# Altium schematic sheet Information.SchDoc
size B; SheetNumber: 1; SheetTotal: 15
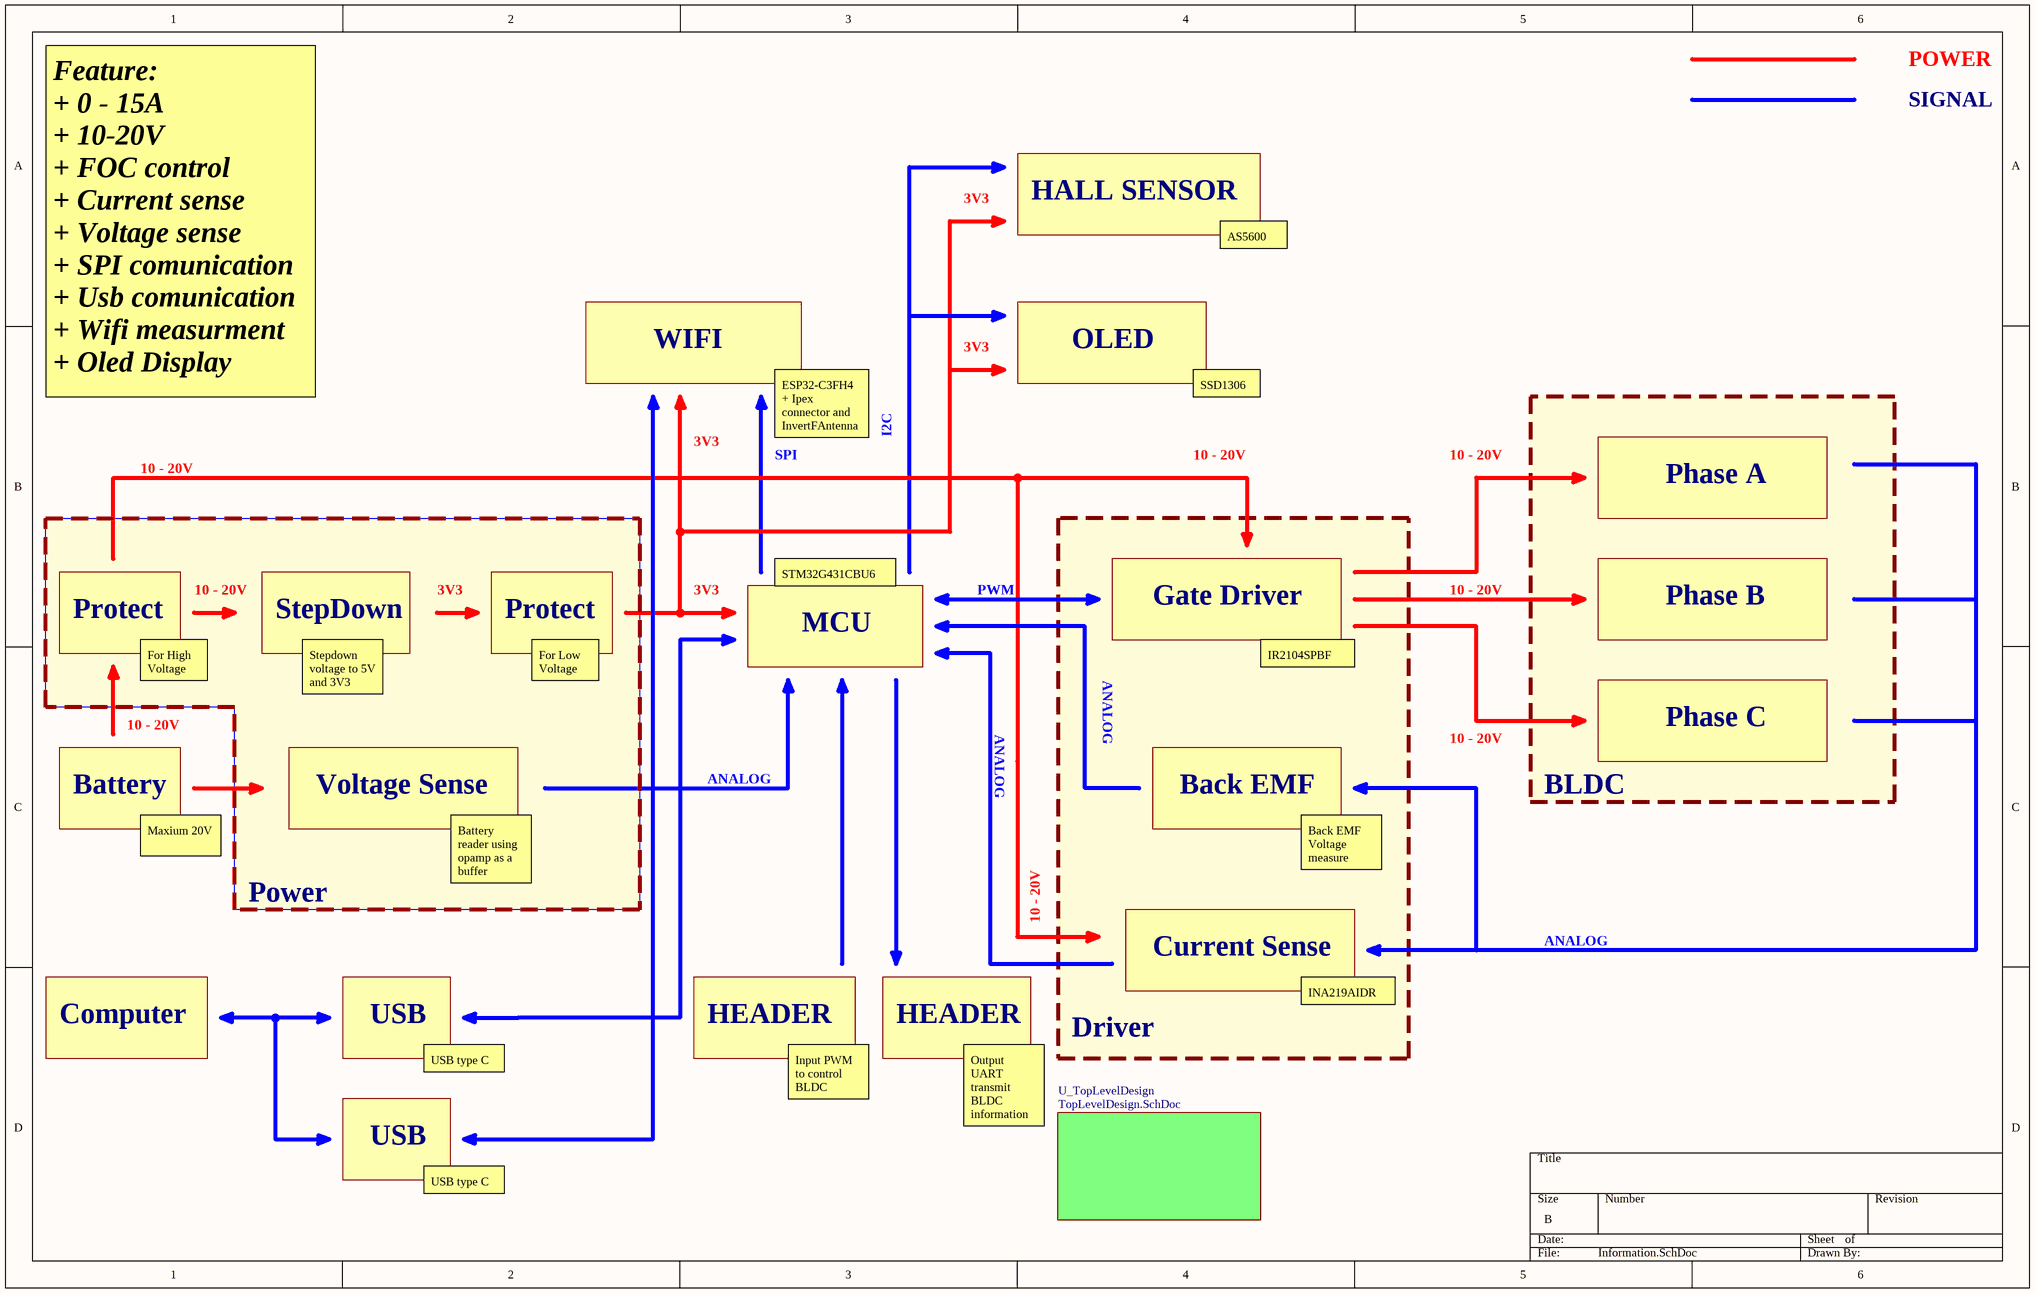
[diagram p0: Information.SchDoc]

## Sub-sheets
U_TopLevelDesign = TopLevelDesign.SchDoc: no entries

## Notes on the sheet
- POWER
- SIGNAL
- 3V3
- HALL SENSOR
- AS5600
- WIFI
- OLED
- Feature:
  + 0 - 15A
  + 10-20V
  + FOC control
  + Current sense
  + Voltage sense
  + SPI comunication
  + Usb comunication
  + Wifi measurment
  + Oled Display
- ESP32-C3FH4 + Ipex connector and InvertFAntenna
- I2C
- SSD1306
- 10 - 20V
- SPI
- Phase A
- Protect
- StepDown
- STM32G431CBU6
- MCU
- PWM
- Gate Driver
- Phase B
- For High Voltage
- Stepdown voltage to 5V and 3V3
- For Low Voltage
- ANALOG
- IR2104SPBF
- Phase C
- Battery
- Voltage Sense
- Back EMF
- BLDC
- Maxium 20V
- Power
- Battery reader using opamp as a buffer
- Back EMF Voltage measure
- Current Sense
- Computer
- USB
- HEADER
- Driver
- INA219AIDR
- USB type C
- Input PWM to control BLDC
- Output UART transmit BLDC information